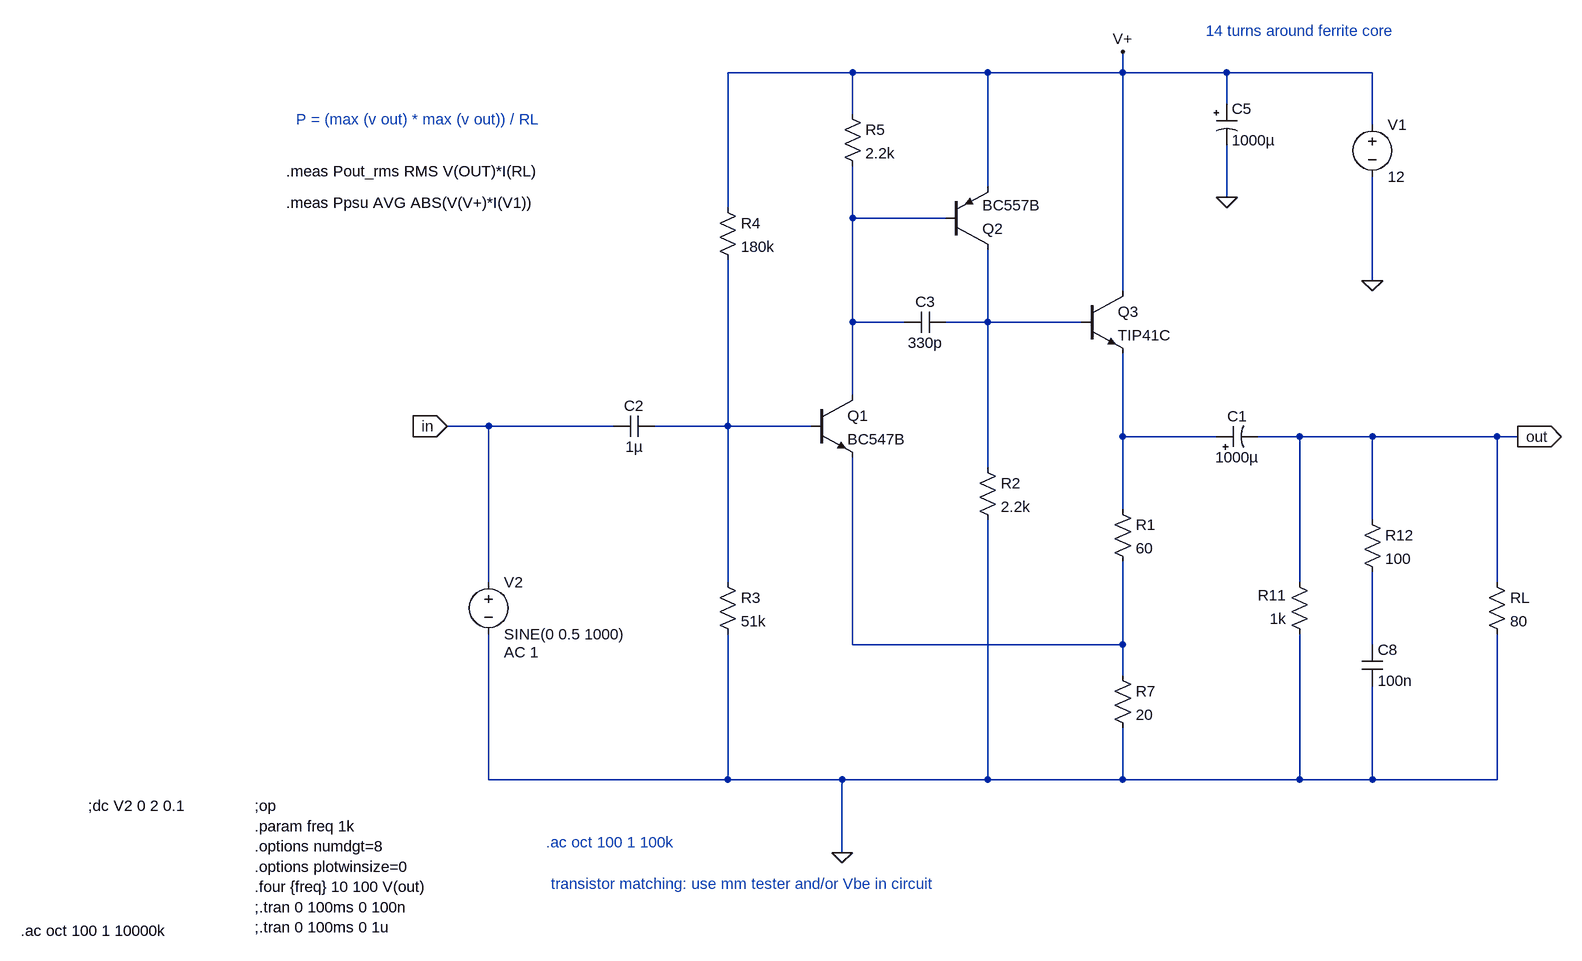
[diagram p0: schematic schematic-freq.asc]
schematic-freq.asc, the LTspice schematic file:
Version 4
SHEET 1 1296 884
WIRE 64 -592 -128 -592
WIRE 272 -592 64 -592
WIRE 480 -592 480 -624
WIRE 480 -592 272 -592
WIRE 640 -592 480 -592
WIRE 864 -592 640 -592
WIRE 640 -544 640 -592
WIRE 64 -528 64 -592
WIRE 864 -512 864 -592
WIRE 272 -416 272 -592
WIRE 640 -400 640 -480
WIRE -128 -384 -128 -592
WIRE 64 -368 64 -448
WIRE 208 -368 64 -368
WIRE 864 -272 864 -432
WIRE 480 -256 480 -592
WIRE 64 -208 64 -368
WIRE 144 -208 64 -208
WIRE 272 -208 272 -320
WIRE 272 -208 208 -208
WIRE 416 -208 272 -208
WIRE 64 -96 64 -208
WIRE -496 -48 -560 -48
WIRE -304 -48 -496 -48
WIRE -128 -48 -128 -304
WIRE -128 -48 -240 -48
WIRE 0 -48 -128 -48
WIRE 480 -32 480 -160
WIRE 624 -32 480 -32
WIRE 752 -32 688 -32
WIRE 864 -32 752 -32
WIRE 1056 -32 864 -32
WIRE 1088 -32 1056 -32
WIRE 272 16 272 -208
WIRE 480 80 480 -32
WIRE 864 96 864 -32
WIRE -496 192 -496 -48
WIRE -128 192 -128 -48
WIRE 752 192 752 -32
WIRE 1056 192 1056 -32
WIRE 64 288 64 0
WIRE 480 288 480 160
WIRE 480 288 64 288
WIRE 864 288 864 176
WIRE 480 336 480 288
WIRE -496 496 -496 272
WIRE -128 496 -128 272
WIRE -128 496 -496 496
WIRE 48 496 -128 496
WIRE 272 496 272 96
WIRE 272 496 48 496
WIRE 480 496 480 416
WIRE 480 496 272 496
WIRE 752 496 752 272
WIRE 752 496 480 496
WIRE 864 496 864 352
WIRE 864 496 752 496
WIRE 1056 496 1056 272
WIRE 1056 496 864 496
WIRE 48 608 48 496
FLAG 48 608 0
FLAG 864 -272 0
FLAG 640 -400 0
FLAG 1088 -32 out
IOPIN 1088 -32 Out
FLAG -560 -48 in
IOPIN -560 -48 In
FLAG 480 -624 V+
DATAFLAG -48 -48 ""
DATAFLAG 560 -32 ""
DATAFLAG 176 288 ""
DATAFLAG 144 -368 ""
DATAFLAG 352 -208 ""
DATAFLAG 576 -112 "Ie(Q3)"
SYMBOL npn 0 -96 R0
SYMATTR InstName Q1
SYMATTR Value BC547B
SYMBOL pnp 208 -320 M180
SYMATTR InstName Q2
SYMATTR Value BC557B
SYMBOL npn 416 -256 R0
SYMATTR InstName Q3
SYMATTR Value TIP41C
SYMBOL res 1040 176 R0
SYMATTR InstName RL
SYMATTR Value 80
SYMBOL res 464 320 R0
SYMATTR InstName R7
SYMATTR Value 20
SYMATTR SpiceLine pwr=10
SYMBOL res 464 64 R0
SYMATTR InstName R1
SYMATTR Value 60
SYMATTR SpiceLine pwr=10
SYMBOL res 256 0 R0
SYMATTR InstName R2
SYMATTR Value 2.2k
SYMBOL res 48 -544 R0
SYMATTR InstName R5
SYMATTR Value 2.2k
SYMBOL res -144 -400 R0
SYMATTR InstName R4
SYMATTR Value 180k
SYMBOL res -144 176 R0
SYMATTR InstName R3
SYMATTR Value 51k
SYMBOL polcap 624 -16 R270
WINDOW 0 32 32 VTop 2
WINDOW 3 0 32 VBottom 2
SYMATTR InstName C1
SYMATTR Value 1000µ
SYMATTR Description Capacitor
SYMATTR Type cap
SYMBOL voltage 864 -528 R0
WINDOW 123 0 0 Left 0
WINDOW 39 0 0 Left 0
SYMATTR InstName V1
SYMATTR Value 12
SYMBOL voltage -496 176 R0
WINDOW 123 24 124 Left 2
WINDOW 39 0 0 Left 0
SYMATTR Value2 AC 1
SYMATTR InstName V2
SYMATTR Value SINE(0 0.5 1000)
SYMBOL cap 208 -224 R90
WINDOW 0 0 32 VBottom 2
WINDOW 3 32 32 VTop 2
SYMATTR InstName C3
SYMATTR Value 330p
SYMBOL polcap 624 -544 R0
SYMATTR InstName C5
SYMATTR Value 1000µ
SYMATTR Description Capacitor
SYMATTR Type cap
SYMATTR SpiceLine V=25
SYMBOL res 768 288 R180
WINDOW 0 36 76 Left 2
WINDOW 3 36 40 Left 2
SYMATTR InstName R11
SYMATTR Value 1k
SYMBOL cap -240 -64 R90
WINDOW 0 0 32 VBottom 2
WINDOW 3 32 32 VTop 2
SYMATTR InstName C2
SYMATTR Value 1µ
SYMBOL res 848 80 R0
SYMATTR InstName R12
SYMATTR Value 100
SYMBOL cap 848 288 R0
SYMATTR InstName C8
SYMATTR Value 100n
TEXT -856 536 Left 2 !;op\n.param freq 1k\n.options numdgt=8\n.options plotwinsize=0\n.four {freq} 10 100 V(out)\n;.tran 0 100ms 0 100n\n;.tran 0 100ms 0 1u
TEXT -1112 536 Left 2 !;dc V2 0 2 0.1
TEXT -408 592 Left 2 ;.ac oct 100 1 100k
TEXT 608 -656 Left 2 ;14 turns around ferrite core
TEXT -400 656 Left 2 ;transistor matching: use mm tester and/or Vbe in circuit
TEXT -808 -440 Left 2 !.meas Pout_rms RMS V(OUT)*I(RL)
TEXT -808 -392 Left 2 !.meas Ppsu AVG ABS(V(V+)*I(V1))
TEXT -792 -520 Left 2 ;P = (max (v out) * max (v out)) / RL
TEXT -1216 728 Left 2 !.ac oct 100 1 10000k

The netlist it stands for:
* schematic-freq.asc
Q1 N001 N003 N005 0 BC547B
Q2 N002 N001 V+ 0 BC557B
Q3 V+ N002 N004 0 TIP41C
RL out 0 80
R7 N005 0 20 pwr=10
R1 N004 N005 60 pwr=10
R2 N002 0 2.2k
R5 V+ N001 2.2k
R4 V+ N003 180k
R3 N003 0 51k
C1 N004 out 1000µ
V1 V+ 0 12
V2 in 0 SINE(0 0.5 1000) AC 1
C3 N002 N001 330p
C5 V+ 0 1000µ V=25
R11 0 out 1k
C2 N003 in 1µ
R12 out N006 100
C8 N006 0 100n
.model NPN NPN
.model PNP PNP
.lib standard.bjt
;op
.param freq 1k
.options numdgt=8
.options plotwinsize=0
.four {freq} 10 100 V(out)
;.tran 0 100ms 0 100n
;.tran 0 100ms 0 1u
;dc V2 0 2 0.1
* .ac oct 100 1 100k
* 14 turns around ferrite core
* transistor matching: use mm tester and/or Vbe in circuit
.meas Pout_rms RMS V(OUT)*I(RL)
.meas Ppsu AVG ABS(V(V+)*I(V1))
* P = (max (v out) * max (v out)) / RL
.ac oct 100 1 10000k
.backanno
.end